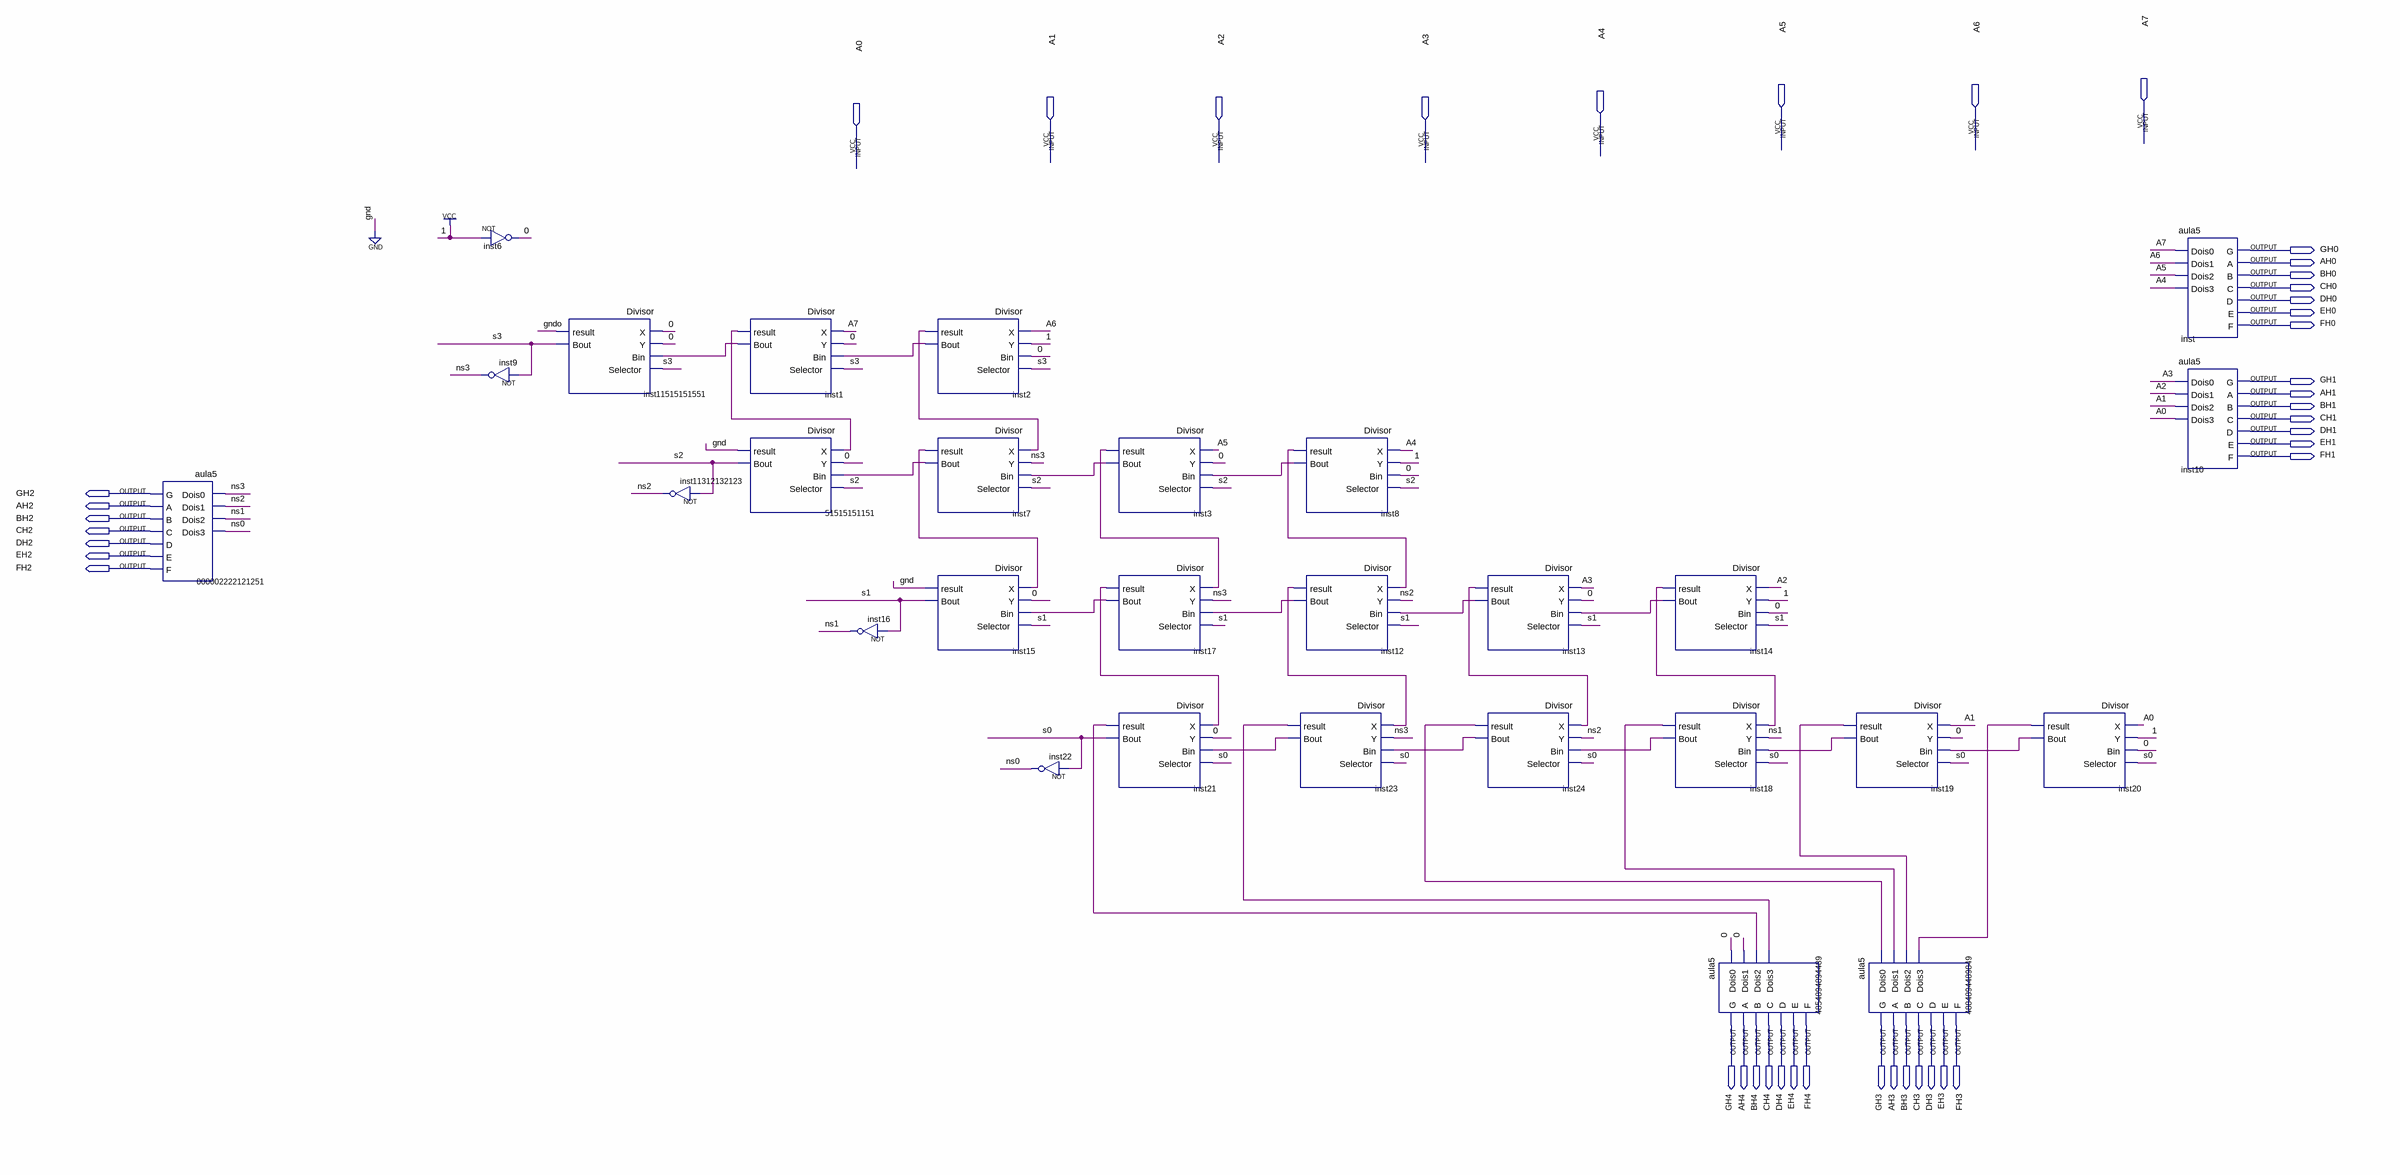
[diagram p0: schematic sheet]
// Quartus schematic aula12.bdf as structural Verilog: 28 symbols, 43 pins
module aula12 (
  input  A7,
  input  A5,
  input  A6,
  input  A4,
  input  A1,
  input  A2,
  input  A3,
  input  A0,
  output GH0,
  output AH0,
  output BH0,
  output CH0,
  output DH0,
  output EH0,
  output FH0,
  output GH1,
  output AH1,
  output BH1,
  output CH1,
  output DH1,
  output EH1,
  output FH1,
  output GH2,
  output AH2,
  output BH2,
  output CH2,
  output DH2,
  output EH2,
  output FH2,
  output GH4,
  output AH4,
  output BH4,
  output CH4,
  output DH4,
  output EH4,
  output FH4,
  output GH3,
  output AH3,
  output BH3,
  output CH3,
  output DH3,
  output EH3,
  output FH3
);

  wire \0 , gnd, gndo, inst1_bout, inst1_result, inst2_bout, inst2_result, inst3_bout, inst3_result,
       inst7_bout, inst7_result, inst8_bout, inst8_result, inst12_bout, inst12_result, inst13_bout,
       inst13_result, inst14_bout, inst14_result, inst17_bout, inst17_result, inst18_bout, inst18_result,
       inst19_bout, inst19_result, inst20_bout, inst20_result, inst21_result, inst23_bout, inst23_result,
       inst24_bout, inst24_result, ns0, ns1, ns2, ns3, s0, s1, s2, s3;

  aula5 u_000002222121251 (
    .Dois0(ns3), .Dois1(ns2), .Dois2(ns1), .Dois3(ns0), .G(GH2), .A(AH2), .B(BH2), .C(CH2), .D(DH2), .E(EH2),
    .F(FH2));
  not inst6 (\0 , 1'b1);
  not inst9 (ns3, s3);
  Divisor inst11515151551 (.X(\0 ), .Y(\0 ), .Bin(inst1_bout), .Selector(s3), .result(gndo), .Bout(s3));
  not inst11312132123 (ns2, s2);
  Divisor inst1 (.X(A7), .Y(\0 ), .Bin(inst2_bout), .Selector(s3), .result(inst1_result), .Bout(inst1_bout));
  Divisor u_51515151151 (.X(inst1_result), .Y(\0 ), .Bin(inst7_bout), .Selector(s2), .result(gnd), .Bout(s2));
  not inst16 (ns1, s1);
  Divisor inst2 (.X(A6), .Y(1'b1), .Bin(\0 ), .Selector(s3), .result(inst2_result), .Bout(inst2_bout));
  Divisor inst7 (.X(inst2_result), .Y(ns3), .Bin(inst3_bout), .Selector(s2), .result(inst7_result), .Bout(inst7_bout));
  Divisor inst15 (.X(inst7_result), .Y(\0 ), .Bin(inst17_bout), .Selector(s1), .result(gnd), .Bout(s1));
  not inst22 (ns0, s0);
  Divisor inst3 (.X(A5), .Y(\0 ), .Bin(inst8_bout), .Selector(s2), .result(inst3_result), .Bout(inst3_bout));
  Divisor inst17 (
    .X(inst3_result), .Y(ns3), .Bin(inst12_bout), .Selector(s1), .result(inst17_result), .Bout(inst17_bout));
  Divisor inst21 (.X(inst17_result), .Y(\0 ), .Bin(inst23_bout), .Selector(s0), .result(inst21_result), .Bout(s0));
  Divisor inst8 (.X(A4), .Y(1'b1), .Bin(\0 ), .Selector(s2), .result(inst8_result), .Bout(inst8_bout));
  Divisor inst12 (
    .X(inst8_result), .Y(ns2), .Bin(inst13_bout), .Selector(s1), .result(inst12_result), .Bout(inst12_bout));
  Divisor inst23 (
    .X(inst12_result), .Y(ns3), .Bin(inst24_bout), .Selector(s0), .result(inst23_result), .Bout(inst23_bout));
  Divisor inst13 (.X(A3), .Y(\0 ), .Bin(inst14_bout), .Selector(s1), .result(inst13_result), .Bout(inst13_bout));
  Divisor inst24 (
    .X(inst13_result), .Y(ns2), .Bin(inst18_bout), .Selector(s0), .result(inst24_result), .Bout(inst24_bout));
  Divisor inst14 (.X(A2), .Y(1'b1), .Bin(\0 ), .Selector(s1), .result(inst14_result), .Bout(inst14_bout));
  Divisor inst18 (
    .X(inst14_result), .Y(ns1), .Bin(inst19_bout), .Selector(s0), .result(inst18_result), .Bout(inst18_bout));
  aula5 u_4854894894489 (
    .Dois0(\0 ), .Dois1(\0 ), .Dois2(inst21_result), .Dois3(inst23_result), .G(GH4), .A(AH4), .B(BH4),
    .C(CH4), .D(DH4), .E(EH4), .F(FH4));
  Divisor inst19 (.X(A1), .Y(\0 ), .Bin(inst20_bout), .Selector(s0), .result(inst19_result), .Bout(inst19_bout));
  aula5 u_4884894489849 (
    .Dois0(inst24_result), .Dois1(inst18_result), .Dois2(inst19_result), .Dois3(inst20_result), .G(GH3),
    .A(AH3), .B(BH3), .C(CH3), .D(DH3), .E(EH3), .F(FH3));
  Divisor inst20 (.X(A0), .Y(1'b1), .Bin(\0 ), .Selector(s0), .result(inst20_result), .Bout(inst20_bout));
  aula5 inst (
    .Dois0(A7), .Dois1(A6), .Dois2(A5), .Dois3(A4), .G(GH0), .A(AH0), .B(BH0), .C(CH0), .D(DH0), .E(EH0),
    .F(FH0));
  aula5 inst10 (
    .Dois0(A3), .Dois1(A2), .Dois2(A1), .Dois3(A0), .G(GH1), .A(AH1), .B(BH1), .C(CH1), .D(DH1), .E(EH1),
    .F(FH1));
  // also tied to GND on the sheet: gnd
endmodule
